# Altium schematic sheet [04] - Master_Power.SchDoc: =ProjectName
size A4; CheckedBy: DatNB; Author: Ven; CompanyName: Nacentech; Organization: IMET
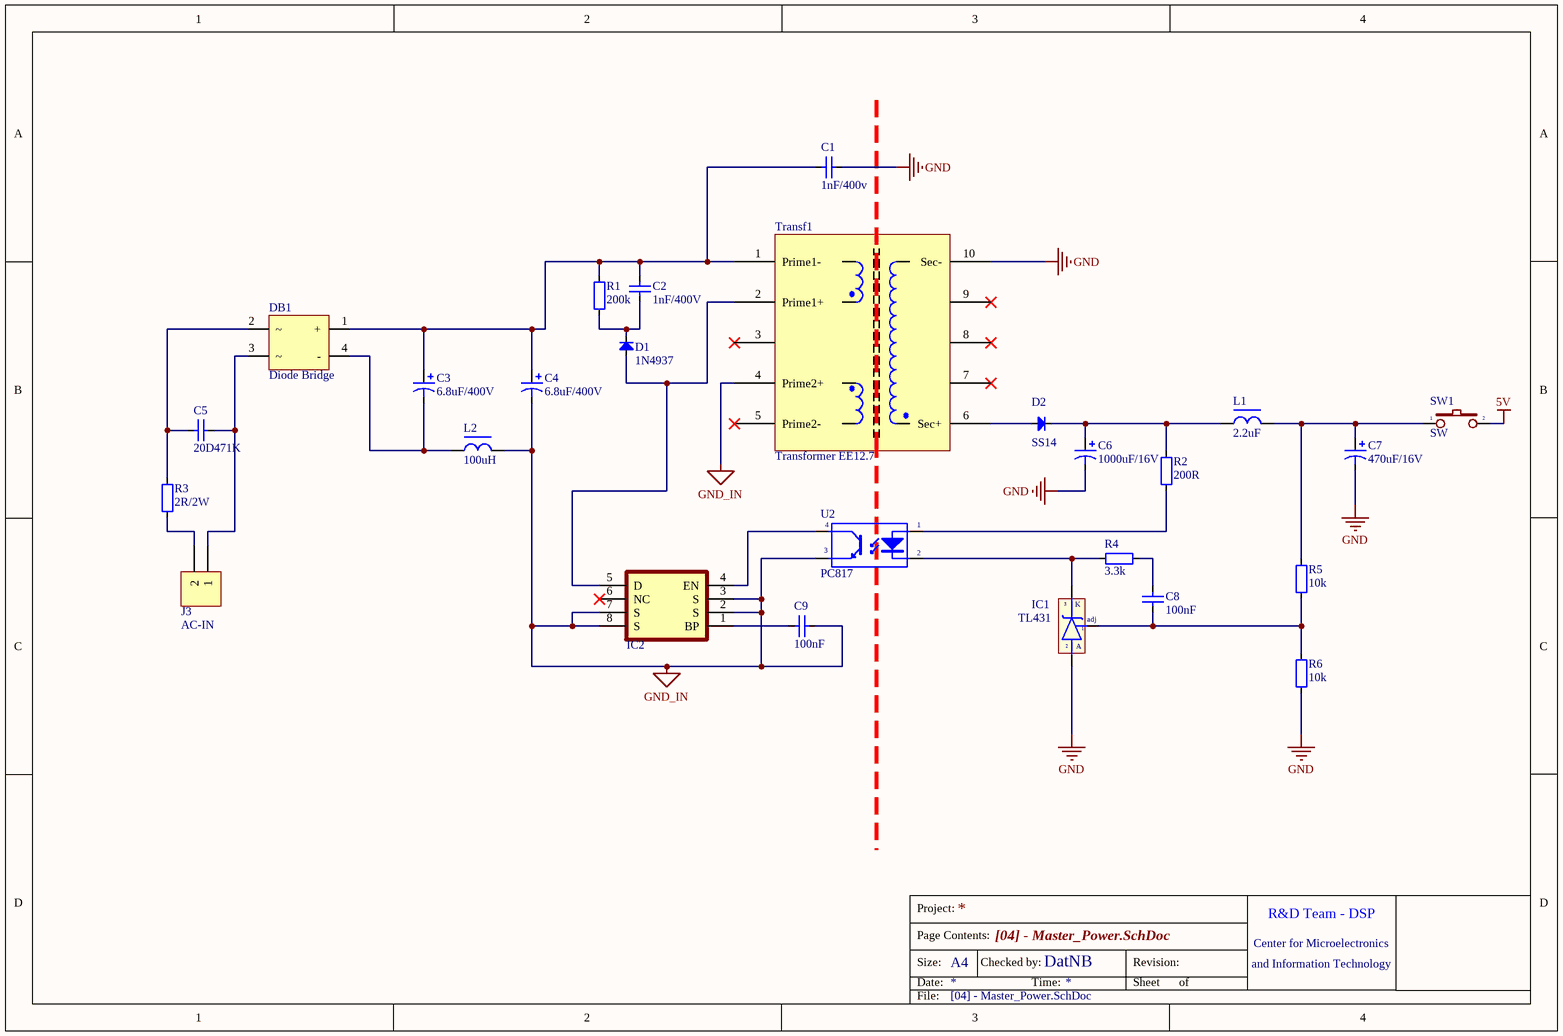
[diagram p0: [04] - Master_Power.SchDoc]

## Parts
C1  1nF/400v  [103/2KV]
C2  1nF/400V  [103/2KV]
C3  6.8uF/400V  [C8mm]
C4  6.8uF/400V  [C8mm]
C5  20D471K  [103/2KV]
C6  1000uF/16V  [C8mm]
C7  470uF/16V  [C8mm]
C8  100nF  [CAP_0805]
C9  100nF  [CAP_0805]
D1  1N4937  [DIO-1AN]
D2  SS14  [DO-214AC(SMA)]
DB1  Diode Bridge  [DB207S]
IC1  TL431  [qto-92]
IC2  TNY264  [DIP8]  (value not drawn)
J3  AC-IN  [KF2-5.08]
L1  2.2uF  [L-SMD-M-7.3x4.5]
L2  100uH  [L-DIP-M-9.5x6]
R1  200k  [RES-1/4WD]
R2  200R  [RES-SMD-0805]
R3  2R/2W  [RES-1WD]
R4  3.3k  [RES-SMD-0805]
R5  10k  [RES-SMD-0805]
R6  10k  [RES-SMD-0805]
SW1  SW  [SW2]
Transf1  Transformer EE12.7  [Transformer EE12.7]
U2  PC817  [DIP4/W0.3]

## Nets
5V: SW1.2
GND: C1.1 C6.2 C7.2 IC1.2(A) R6.2 Transf1.10(Sec-)
GND_IN: C4.2 C9.1 IC2.2(S) IC2.3(S) IC2.7(S) IC2.8(S) L2.2 Transf1.4(Prime2+) U2.3(E)
NetC1_2: C1.2 C2.1 C3.1 C4.1 DB1.1(+) R1.2 Transf1.1(Prime1-)
NetC2_2: C2.2 D1.2(K) R1.1
NetC3_2: C3.2 DB1.4(-) L2.1
NetC5_1: C5.1 DB1.3 J3.1
NetC5_2: C5.2 DB1.2 R3.1
NetC6_1: C6.1 D2.2(K) L1.1 R2.1
NetC7_1: C7.1 L1.2 R5.1 SW1.1
NetC8_1: C8.1 IC1.1(adj) R5.2 R6.1
NetC8_2: C8.2 R4.2
NetC9_2: C9.2 IC2.1(BP)
NetD1_1: D1.1(A) IC2.5(D) Transf1.2(Prime1+)
NetD2_1: D2.1(A) Transf1.6(Sec+)
NetIC1_3: IC1.3(K) R4.1 U2.2(K)
NetIC2_4: IC2.4(EN) U2.4(C)
NetJ3_2: J3.2 R3.2
NetR2_2: R2.2 U2.1(A)

Not connected (* = marked no-connect by the designer): IC2 6(NC)*; Transf1 3* 5(Prime2-)* 7* 8* 9*

## Notes on the sheet
- Project:
- R&D Team - DSP
- Page Contents:
- Size:
- Date:
- A4
- Checked by:
- Time:
- Revision:
- Sheet
- of
- Center for Microelectronics
- and Information Technology
- File:

## Library data of the parts
C1 C2 = Cap2KV: CAP CERAMIC; Published: 8-Jun-2000; LatestRevisionDate: 17-Jul-2002; LatestRevisionNote: Re-released for DXP Platform.; PackageReference: RAD-0.3; Publisher: Altium Limited
C3 C4 C6 C7 = Cap Pol: Polarized Capacitor (Axial); Published: 8-Jun-2000; LatestRevisionDate: 17-Jul-2002; LatestRevisionNote: Re-released for DXP Platform.; PackageReference: POLAR0.8; Publisher: Altium Limited
C5 = Cap2KV: Varistor; Published: 8-Jun-2000; LatestRevisionDate: 17-Jul-2002; LatestRevisionNote: Re-released for DXP Platform.; PackageReference: RAD-0.3; Publisher: Altium Limited
C8 C9 = CapSMD: Capacitor; Value: 33p; Published: 8-Jun-2000; LatestRevisionDate: 17-Jul-2002; LatestRevisionNote: Re-released for DXP Platform.; PackageReference: RAD-0.3; Publisher: Altium Limited
D1 = Diode SMD: Diode Schottky / 1N4937; Code - JEDEC: DO-214-AB; Value: 1N5007; Published: 8-Jun-2000; Revision: July-2002: Re-released for DXP Platform.; Publisher: Altium Limited
D2 = Diode SMD: Diode Schottky / 1N5819; Code - JEDEC: DO-214-AB; Value: 1N5007; Published: 8-Jun-2000; Revision: July-2002: Re-released for DXP Platform.; Publisher: Altium Limited
DB1 = Diode Bridge Flate
IC1 = TL431: Programmable Shunt Regulator; Value: TL431
IC2 = TNY264: Enhanced, Energy Efficient, Low Power Off-line Switcher
J3 = KF2: Manufacturer: Würth Elektronik eiSos GmbH; partNo: 691103110002; ComponentLink1 Description: Manufacturer; ComponentLink2 Description: Datasheet; NoPins: 2; Created Date: 29 October 2013; ComponentLink1URL: http://www.we-online.com; ComponentLink2URL: http://katalog.we-online.de/em/datasheet/6911031100xx.pdf; Created by: Karrer Zheng
L1 L2 = L-DIP-1: Inductor; Value: 150 mH
R1-R6 = Resistor - SMD: Resistor; Manufacturer: Generic Components; Class: Passive; Published: 08/06/2000; Publisher: Altium Hobart Technology Centre
SW1 = SW2: Switch button 2 pin; Value: SW chip 2 pin
Transf1 = Tranformer EE16
U2 = PC817: Single Opto; Value: PC817